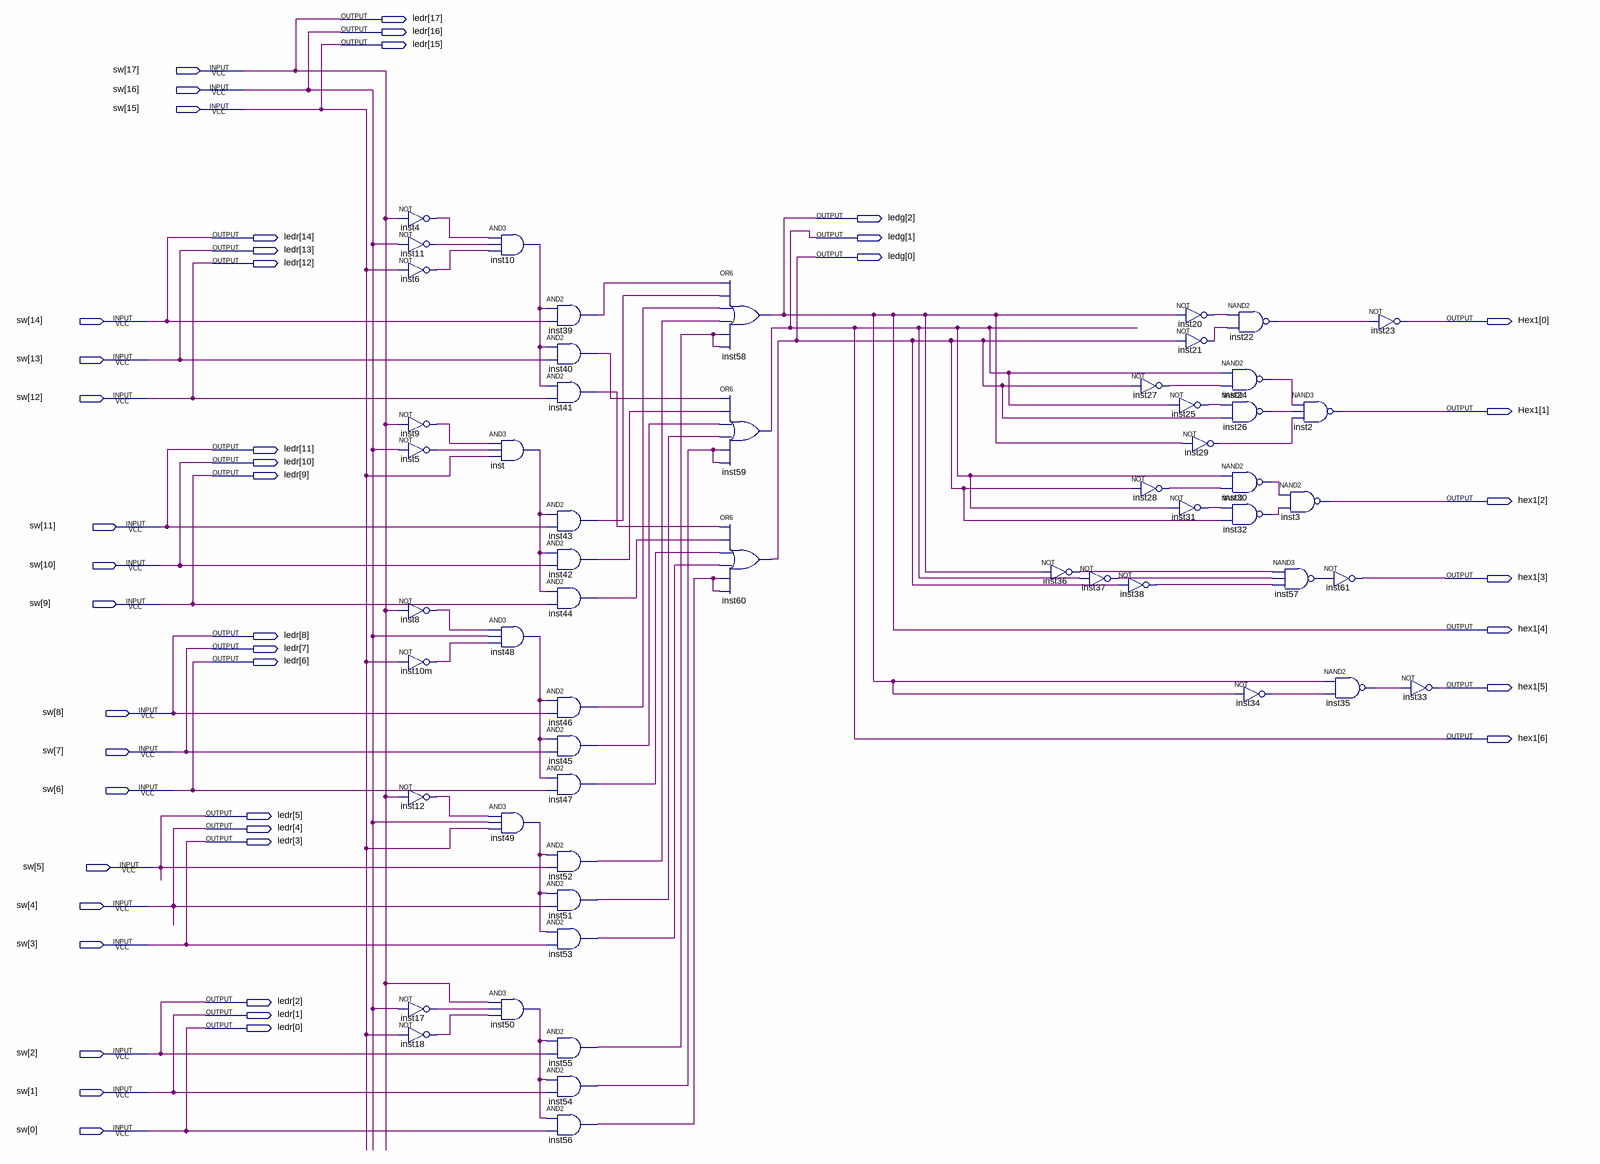
[diagram p0: schematic sheet]
// Quartus schematic ttttt.bdf as structural Verilog: 56 symbols, 46 pins
module ttttt (
  input  [17:0] sw,
  output [17:0] ledr,
  output [2:0] ledg,
  output [6:0] Hex1
);

  wire inst4_out, inst5_out, inst6_out, inst8_out, inst9_out, inst10_out, inst10m_out, inst11_out,
       inst12_out, inst17_out, inst18_out, inst20_out, inst21_out, inst22_out, inst24_out, inst25_out,
       inst26_out, inst27_out, inst28_out, inst29_out, inst30_out, inst31_out, inst32_out, inst34_out,
       inst35_out, inst36_out, inst37_out, inst38_out, inst39_out, inst40_out, inst41_out, inst42_out,
       inst43_out, inst44_out, inst45_out, inst46_out, inst47_out, inst48_out, inst49_out, inst50_out,
       inst51_out, inst52_out, inst53_out, inst54_out, inst55_out, inst56_out, inst57_out, inst_out;

  not inst4 (inst4_out, sw[17]);
  not inst11 (inst11_out, sw[16]);
  not inst6 (inst6_out, sw[15]);
  not inst9 (inst9_out, sw[17]);
  not inst5 (inst5_out, sw[16]);
  not inst8 (inst8_out, sw[17]);
  not inst10m (inst10m_out, sw[15]);
  not inst12 (inst12_out, sw[17]);
  not inst17 (inst17_out, sw[16]);
  not inst18 (inst18_out, sw[15]);
  and inst10 (inst10_out, inst4_out, inst11_out, inst6_out);
  and inst (inst_out, inst9_out, inst5_out, sw[15]);
  and inst48 (inst48_out, inst8_out, sw[16], inst10m_out);
  and inst49 (inst49_out, inst12_out, sw[16], sw[15]);
  and inst50 (inst50_out, sw[17], inst17_out, inst18_out);
  and inst39 (inst39_out, inst10_out, sw[14]);
  and inst40 (inst40_out, inst10_out, sw[13]);
  and inst41 (inst41_out, inst10_out, sw[12]);
  and inst43 (inst43_out, inst_out, sw[11]);
  and inst42 (inst42_out, inst_out, sw[10]);
  and inst44 (inst44_out, inst_out, sw[9]);
  and inst46 (inst46_out, inst48_out, sw[8]);
  and inst45 (inst45_out, inst48_out, sw[7]);
  and inst47 (inst47_out, inst48_out, sw[6]);
  and inst52 (inst52_out, inst49_out, sw[5]);
  and inst51 (inst51_out, inst49_out, sw[4]);
  and inst53 (inst53_out, inst49_out, sw[3]);
  and inst55 (inst55_out, inst50_out, sw[2]);
  and inst54 (inst54_out, inst50_out, sw[1]);
  and inst56 (inst56_out, inst50_out, sw[0]);
  or inst58 (Hex1[4], inst39_out, inst43_out, inst46_out, inst52_out, inst55_out, inst55_out);
  or inst59 (Hex1[6], inst40_out, inst42_out, inst45_out, inst51_out, inst54_out, inst54_out);
  or inst60 (ledg[0], inst41_out, inst44_out, inst47_out, inst53_out, inst56_out, inst56_out);
  not inst36 (inst36_out, Hex1[4]);
  not inst37 (inst37_out, Hex1[6]);
  not inst27 (inst27_out, ledg[0]);
  not inst28 (inst28_out, ledg[0]);
  not inst38 (inst38_out, ledg[0]);
  not inst20 (inst20_out, Hex1[4]);
  not inst21 (inst21_out, ledg[0]);
  not inst25 (inst25_out, Hex1[6]);
  not inst29 (inst29_out, Hex1[4]);
  not inst31 (inst31_out, Hex1[6]);
  nand inst22 (inst22_out, inst20_out, inst21_out);
  nand inst24 (inst24_out, Hex1[6], inst27_out);
  nand inst26 (inst26_out, inst25_out, ledg[0]);
  nand inst30 (inst30_out, Hex1[6], inst28_out);
  nand inst32 (inst32_out, inst31_out, ledg[0]);
  not inst34 (inst34_out, Hex1[4]);
  nand inst2 (Hex1[1], inst24_out, inst26_out, inst29_out);
  nand inst3 (Hex1[2], inst30_out, inst32_out);
  nand inst57 (inst57_out, inst36_out, inst37_out, inst38_out);
  not inst61 (Hex1[3], inst57_out);
  nand inst35 (inst35_out, Hex1[4], inst34_out);
  not inst23 (Hex1[0], inst22_out);
  not inst33 (Hex1[5], inst35_out);

  assign ledg[2:1] = {Hex1[4], Hex1[6]};
  assign ledr = sw;
endmodule
